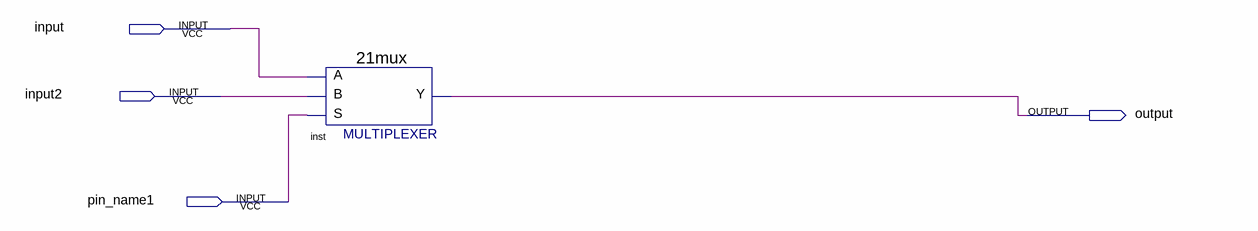
[diagram p0: schematic sheet]
// Quartus schematic muxxxx.bdf as structural Verilog: 1 symbols, 4 pins
module muxxxx (
  input  \input ,
  input  input2,
  input  pin_name1,
  output \output 
);

  \21mux  inst (.S(pin_name1), .B(input2), .A(\input ), .Y(\output ));
endmodule
